# EAGLE schematic RF_Front-End (EAGLE 5.07)
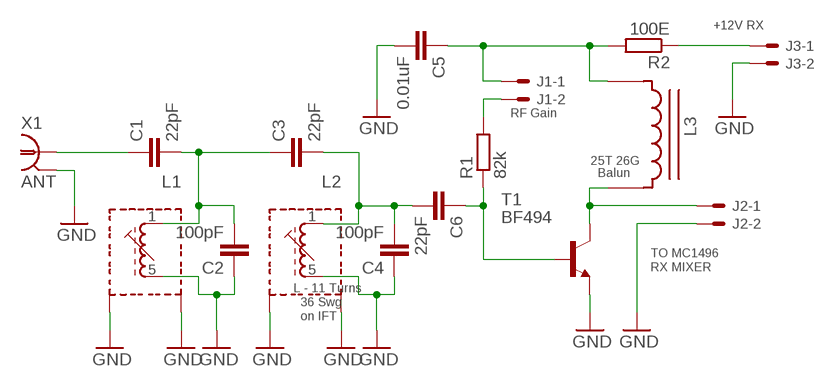
[diagram p0: schematic, sheet 1]

## Parts
C1  22pF  C-EU050-035X075  [C050-035X075]
C2  100pF  C-EU050-035X075  [C050-035X075]
C3  22pF  C-EU050-035X075  [C050-035X075]
C4  100pF  C-EU050-035X075  [C050-035X075]
C5  0.01uF  C-EU050-035X075  [C050-035X075]
C6  22pF  C-EU050-035X075  [C050-035X075]
J1  22-27-2021-02  [6410-02]
J2  22-27-2021-02  [6410-02]
J3  22-27-2021-02  [6410-02]
L1  71K1-1-5  [71K]
L2  71K1-1-5  [71K]
L3  T50_INDUCTOR  [T50_INDUCTOR]
R1  82k  R-EU_0207/10  [0207/10]
R2  100E  R-EU_0207/10  [0207/10]
T1  BF494  BF494-NPN-TO92-CEB  [TO92-CEB]
X1  ANT  1-227161-0  [AMP_227161]

## Nets
GND: C2.1 C4.1 C5.2 J2.2 J3.2 L1.5(E) L1.S1 L1.S2 L2.5(E) L2.S1 L2.S2 T1.E X1.2(GND)
N$1: C1.1 X1.1
N$2: J2.1 L3.CB T1.C
N$3: C3.2 C4.2 C6.2 L2.1(A)
N$4: J3.1 R2.1
N$6: C1.2 C2.2 C3.1 L1.1(A)
N$8: J1.2 R1.2
N$9: C6.1 R1.1 T1.B
N$10: C5.1 J1.1 L3.CA R2.2

## Notes on the sheet
- +12V RX
- RF Gain
- 25T 26G
- Balun
- TO MC1496
- RX MIXER
- L - 11 Turns
- 36 Swg
- on IFT

## Library data of the parts
C1-C6 = rcl:C-EU: CAPACITOR, European symbol
J1-J3 = con-molex:22-?-02: CONNECTOR wire to board 2.54 mm (.1 inch) pitch header
L1 L2 = inductor-neosid:71K1-: FILTER adjustable filter coil, type K
L3 = toroid:T50_INDUCTOR: Inductor wound on a T50 Core
R1 R2 = rcl:R-EU_: RESISTOR, European symbol
T1 = transistor-neu-to92:*-NPN-: NPN Transistror
X1 = con-coax:?227161*: JACK, RIGHT ANGLE, 50 OHM, PCB, BNC Source: amp_227161.pdf